# EAGLE design Blinky_v2 (EAGLE 7.7.0)
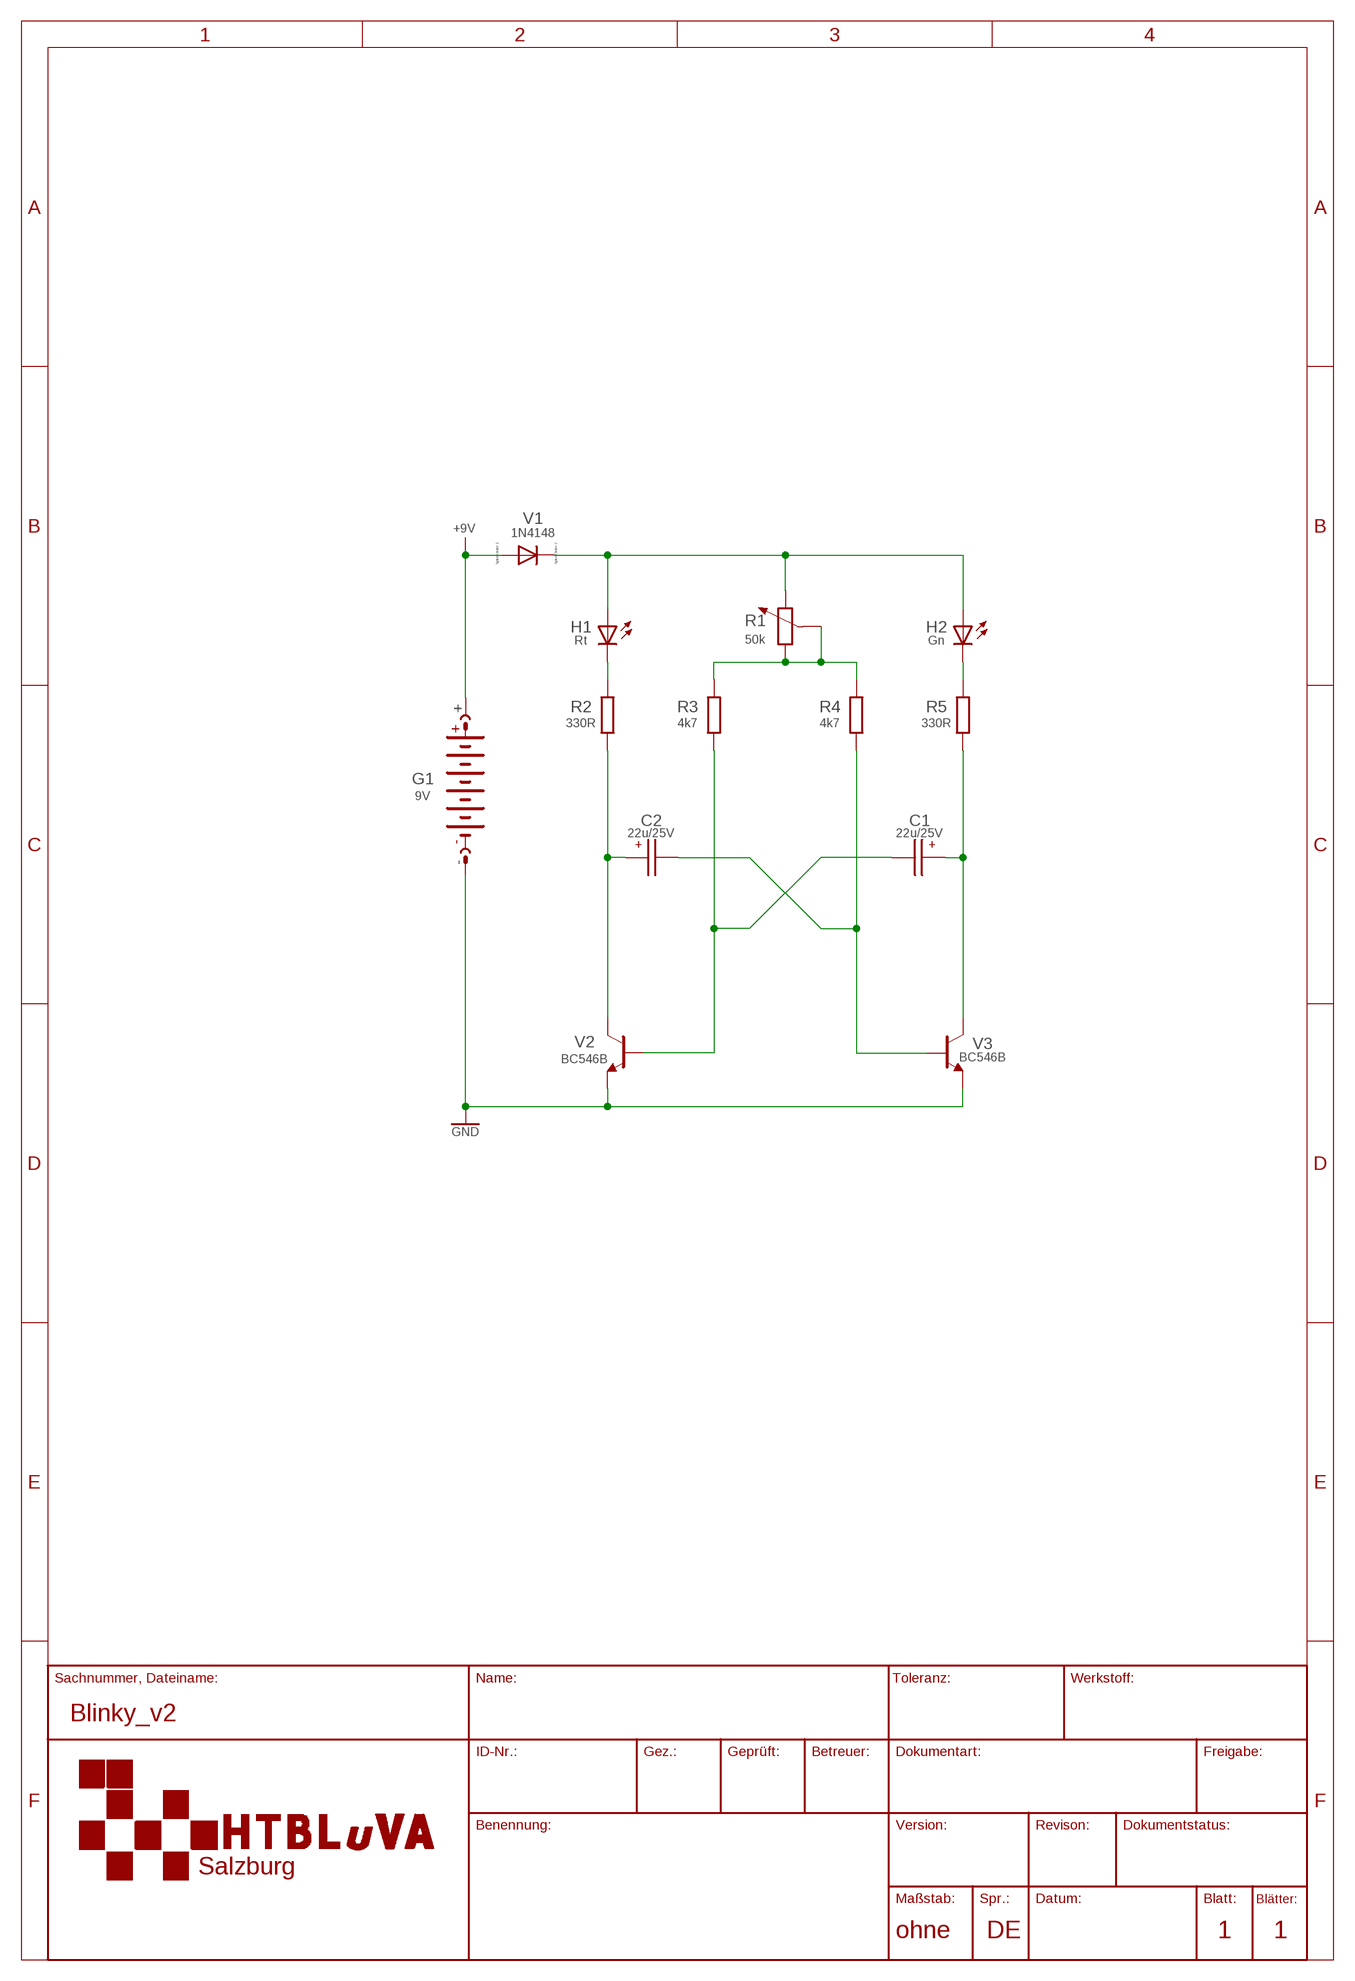
[diagram p0: schematic, sheet 1]

## Parts
C1  22u/25V  CPOL-V_E2-5  [E2-5]
C2  22u/25V  CPOL-V_E2-5  [E2-5]
G1  9V  AB9V9V  [AB9V]
H1  Rt  LED_5MM  [LED5MM]
H2  Gn  LED_5MM  [LED5MM]
R1  50k  R-POT_V_PT-10  [PT-10]
R2  330R  R-H_0207/10  [0207/10]
R3  4k7  R-H_0207/10  [0207/10]
R4  4k7  R-H_0207/10  [0207/10]
R5  330R  R-H_0207/10  [0207/10]
V1  1N4148  1N4148_DO35-7  [DO35-7]
V2  BC546B  [TO92-EBC]
V3  BC546B  [TO92-EBC]

## Nets
+9V: G1.+ V1.A
GND: G1.- V2.E V3.E
N$1: H1.A H2.A R1.2 V1.C
N$2: R1.1 R1.3 R3.2 R4.2
N$3: H2.K(C) R5.2
N$4: H1.K(C) R2.2
N$5: C2.+ R2.1 V2.C
N$6: C1.+ R5.1 V3.C
N$7: C1.- R3.1 V2.B
N$8: C2.- R4.1 V3.B

## Library data of the parts
C1 C2 = rcl_TicA:CPOL-V_: POLARIZED CAPACITOR, European symbol
G1 = Battery_TicA:AB9V: 9-V BATTERY CLIP
H1 H2 = led_TicA:LED_: LED OSRAM: - CHIPLED LG R971, LG N971, LY N971, LG Q971, LY Q971, LO R971, LY R971 LH N974, LH R974 LS Q976, LO Q976, LY Q976 LO Q996 - Hyper CHIPLED LW Q18S LB Q993, LB Q99A, LB R99A - SideLED LS A670, LO A670, LY A670, LG A670, LP A670 LB A673, LV A673, LT A673, LW A673 LH A674 LY A675 LS A676, LA A676, LO A676, LY A676, LW A676 LS A679, LY A679, LG A679 - Hyper Micro SIDELED® LS Y876, LA Y876, LO Y876, LY Y876 LT Y87S - SmartLED LW L88C, LW L88S LB L89C, LB L89S, LG L890 LS L89K, LO L89K, LY L89K LS L896, LA L896, LO L896, LY L896 - TOPLED LS T670, LO T670, LY T670, LG T670, LP T670 LSG T670, LSP T670, LSY T670, LOP T670, LYG T670 LG T671, LOG T671, LSG T671 LB T673, LV T673, LT T673, LW T673 LH T674 LS T676, LA T676, LO T676, LY T676, LB T676, LH T676, LSB T676, LW T676 LB T67C, LV T67C, LT T67C, LS T67K, LO T67K, LY T67K, LW E67C LS E67B, LA E67B, LO E67B, LY E67B, LB E67C, LV E67C, LT E67C LW T67C LS T679, LY T679, LG T679 LS T770, LO T770, LY T770, LG T770, LP T770 LB T773, LV T773, LT T773, LW T773 LH T774 LS E675, LA E675, LY E675, LS T675 LS T776, LA T776, LO T776, LY T776, LB T776 LHGB T686 LT T68C, LB T68C - Hyper Mini TOPLED® LB M676 - Mini TOPLED Santana® LG M470 LS M47K, LO M47K, LY M47K Source: http://www.osram.convergy.de LUXEON: - LUMILED® LXK2-PW12-R00, LXK2-PW12-S00, LXK2-PW14-U00, LXK2-PW14-V00 LXK2-PM12-R00, LXK2-PM12-S00, LXK2-PM14-U00 LXK2-PE12-Q00, LXK2-PE12-R00, LXK2-PE12-S00, LXK2-PE14-T00, LXK2-PE14-U00 LXK2-PB12-K00, LXK2-PB12-L00, LXK2-PB12-M00, LXK2-PB14-N00, LXK2-PB14-P00, LXK2-PB14-Q00 LXK2-PR12-L00, LXK2-PR12-M00, LXK2-PR14-Q00, LXK2-PR14-R00 LXK2-PD12-Q00, LXK2-PD12-R00, LXK2-PD12-S00 LXK2-PH12-R00, LXK2-PH12-S00 LXK2-PL12-P00, LXK2-PL12-Q00, LXK2-PL12-R00 Source: www.luxeon.com KINGBRIGHT: KA-3528ASYC Source: www.kingbright.com
R1 = rcl_TicA:R-POT_V_: Potentiometer
R2-R5 = rcl_TicA:R-H_: RESISTOR, European symbol
V1 = diode_TicA:1N4148_: DIODE high speed (Philips)
V2 V3 = transistor_TicA:BC546*: NPN Transistor

## Board
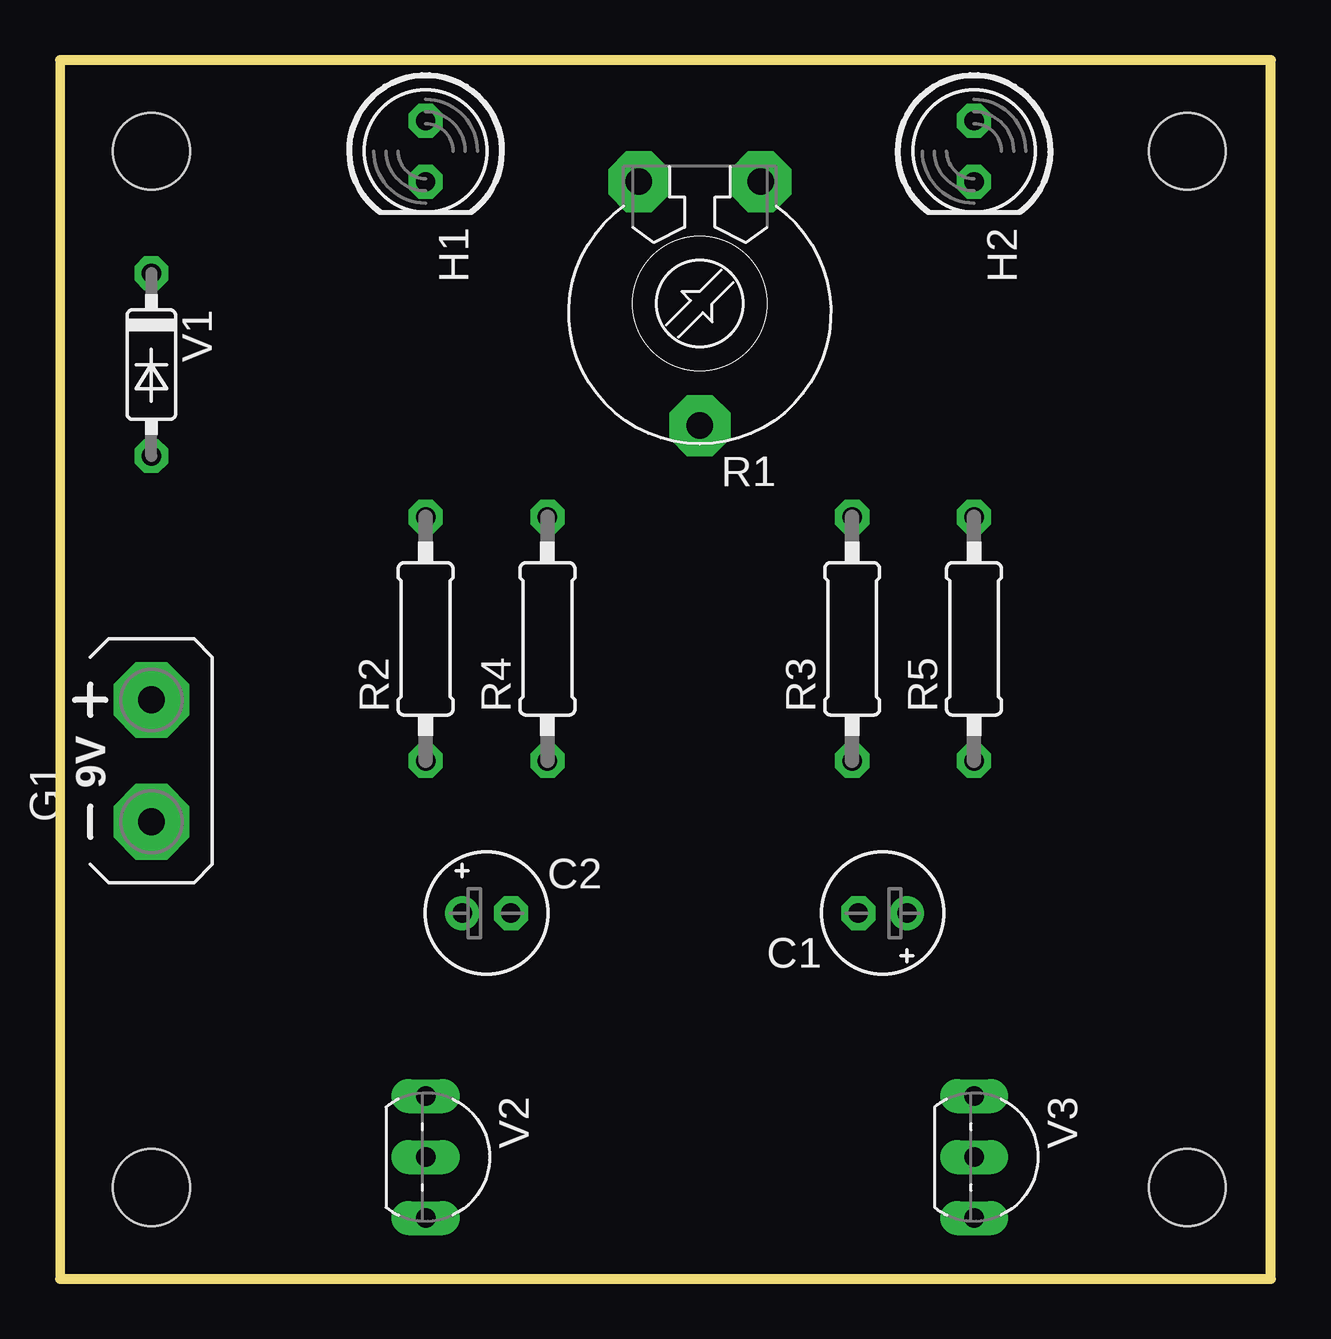
[diagram p1: board, top side]
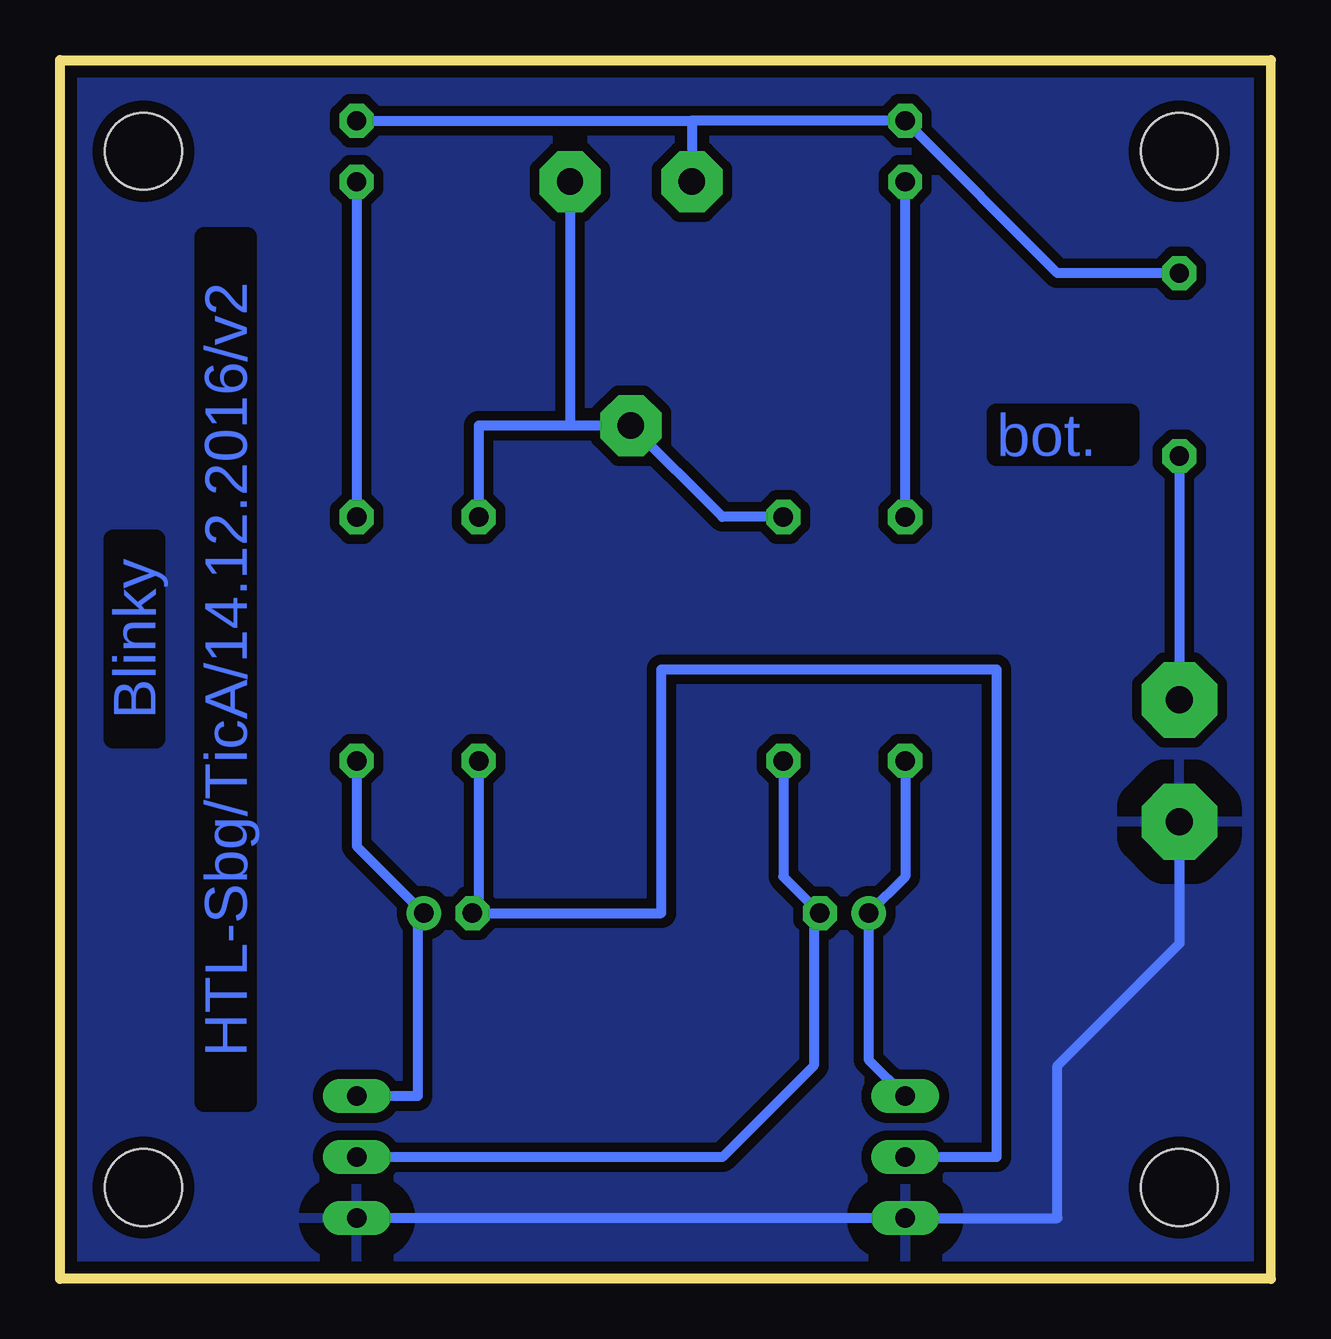
[diagram p2: board, bottom side, seen from below]

Size 50.47 x 50.79 mm. Coordinates in mm from the lower left corner, seen from the top.
Outline: 0,0 50.47,0 50.47,50.79 0,50.79 0,0
Copper layers (1+16): Top 0.035559375mm / dielectric 1.501140625mm / Bottom 0.035559375mm
Design rules "2HN *": minimum track width 16mil, minimum drill 0.599440625mm, track to track 10mil, track to pad 8mil, pad to pad 8mil, via to via 8mil, smd to smd 8mil, copper to edge 20mil, drill to drill 8mil, minimum pad ring 12mil, minimum via ring 13mil, stop-mask expansion 4mil, vias tented up to drill 0mil, thermal gap 40mil
Holes 3.2 mm at 3.81,3.81 46.99,3.81 46.99,46.99 3.81,46.99

### Footprints (pad centres in the part's own frame; a part is rotated, then mirrored left to right if it is on the bottom)
E2-5 = drill 0.813 pad 1.27: + -1.016,0 | drill 0.813 pad 1.27 octagon: - 1.016,0
AB9V = drill 1.118 pad 3.15 octagon: + 0,2.54; - 0,-2.54
LED5MM = drill 0.8 octagon: A -1.27,0; K 1.27,0
PT-10 = drill 1.1 pad 2.54 octagon: 1 -2.54,-5.08; 2 2.54,-5.08; 3 0,5.08
0207/10 = drill 0.813 octagon: 1 -5.08,0; 2 5.08,0
DO35-7 = drill 0.8 octagon: A 3.81,0; C -3.81,0
TO92-EBC = drill 0.813 long: B 0,-1.27; C -2.54,-1.27; E 2.54,-1.27

### Placement (x,y rotation side)
C1  34.29,15.24 180 top
C2  17.78,15.24 0 top
G1  3.81,21.59 0 top
H1  15.24,46.99 270 top
H2  38.1,46.99 270 top
R1  26.67,40.64 180 top
R2  15.24,26.67 90 top
R3  33.02,26.67 90 top
R4  20.32,26.67 90 top
R5  38.1,26.67 90 top
V1  3.81,38.1 270 top
V2  16.51,5.08 270 top
V3  39.37,5.08 270 top

### Tracks (layer width: path | path; a pad name or v marks a point on that pad's centre or on a via)
+9V
  Bottom 0.406: V1.A G1.+
GND
  Bottom 0.406: G1.- 3.81,13.97 8.89,8.89 8.89,2.54 V2.E V3.E
  pour Bottom (isolate 0.406): 0,0 50.8,0 50.8,50.8 0,50.8
N$1
  Bottom 0.406: V1.C 8.89,41.91 H1.A 24.13,48.26 | 24.13,48.26 R1.2 | H2.A 24.13,48.26
N$2
  Bottom 0.406: R1.1 29.21,35.56 | 29.21,35.56 R1.3 22.86,31.75 R4.2 | 29.21,35.56 33.02,35.56 R3.2
N$3
  Bottom 0.406: H2.K R5.2
N$4
  Bottom 0.406: R2.2 H1.K
N$5
  Bottom 0.406: R2.1 15.24,16.76 C2.+ 16.76,9.14 V2.C
N$6
  Bottom 0.406: R5.1 38.1,18.03 C1.+ 35.56,14.99 35.56,7.62 V3.C
N$7
  Bottom 0.406: V2.B 11.43,5.08 11.43,25.4 25.4,25.4 25.4,15.24 C1.- 33.02,15.49 R3.1
N$8
  Bottom 0.406: R4.1 20.32,16.76 C2.- 19.05,14.99 19.05,8.89 22.86,5.08 V3.B

### Text on the board
Bottom: bot. | Blinky | HTL-Sbg/TicA/14.12.2016/v2